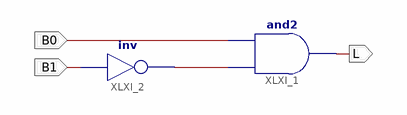
[diagram p0: schematic sheet 1]
// Xilinx ISE schematic LoadSelect.sch (spartan3e) as structural Verilog: 2 symbols, 3 ports
module LoadSelect (
  input  B0,
  input  B1,
  output L
);

  wire XLXN_3;

  and XLXI_1 (L, XLXN_3, B0);
  not XLXI_2 (XLXN_3, B1);
endmodule
